# Altium schematic sheet [04] - CONNECTORS_2.SchDoc
size A4; DocumentNumber: 5; SheetNumber: 5; SheetTotal: 9
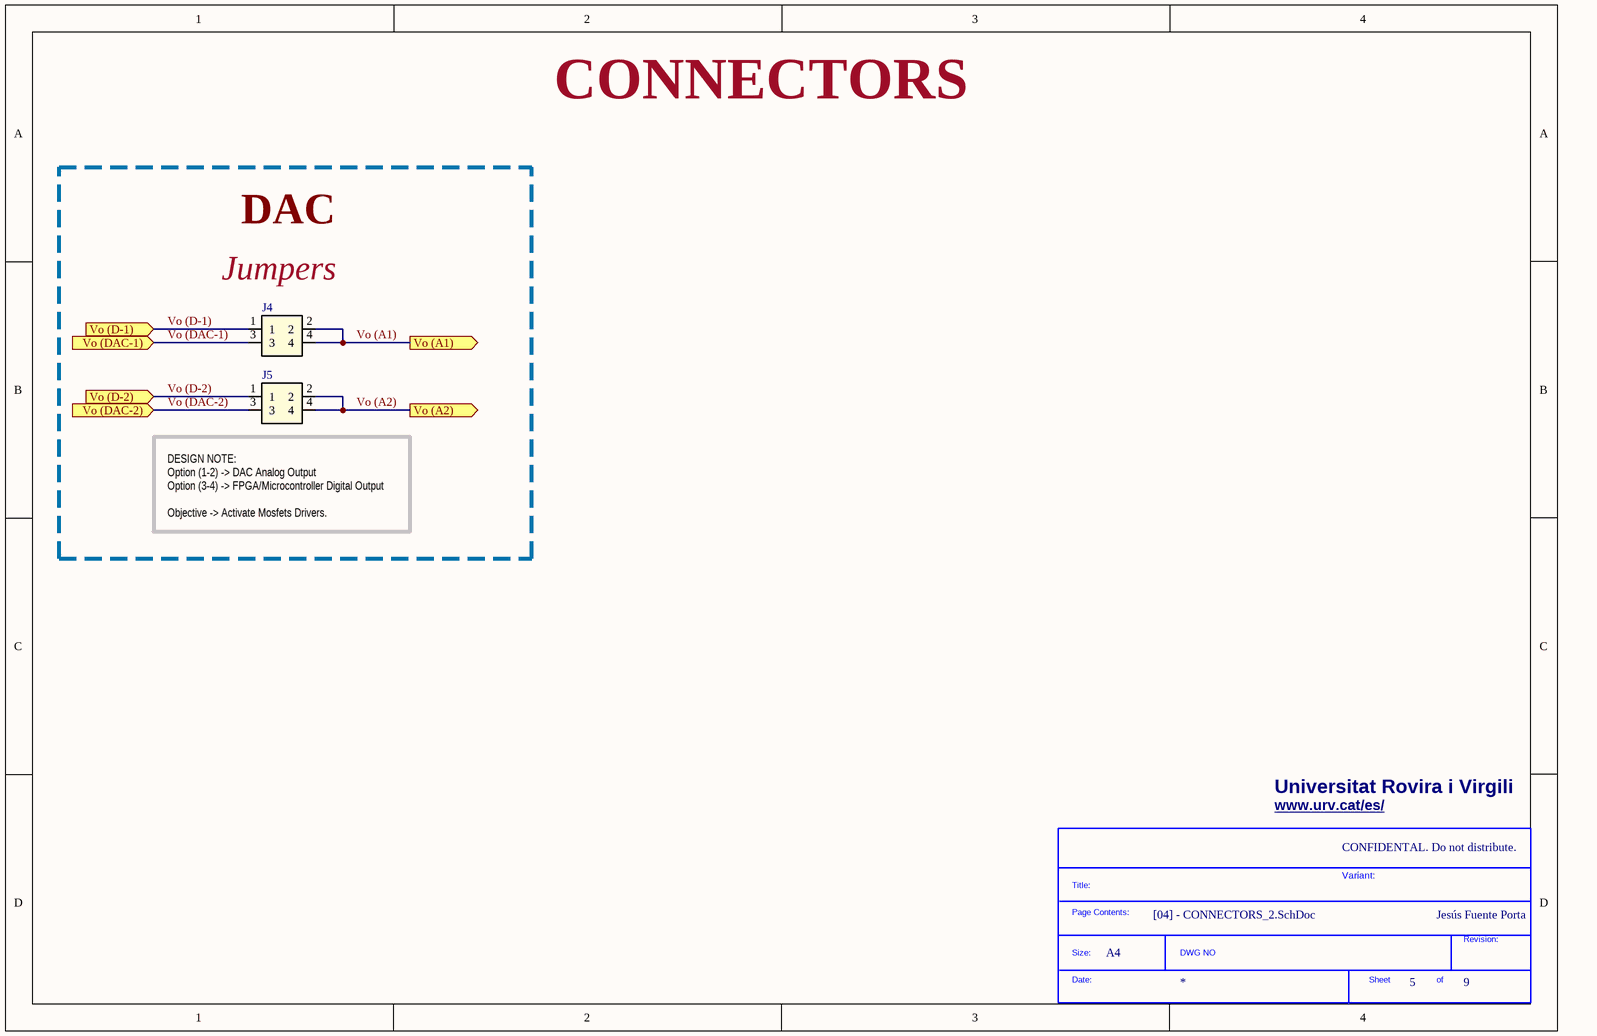
[diagram p0: [04] - CONNECTORS_2.SchDoc]

## Parts
*?  SDTitleBlock  (value not drawn)  (graphical)
J4  TMM-102-01-G-D00 (2 connectors)  [TMM-102-01-G-D00 (2 connectors)]  (value not drawn)
J5  TMM-102-01-G-D00 (2 connectors)  [TMM-102-01-G-D00 (2 connectors)]  (value not drawn)

## Blocks framed on the sheet
DAC: J4 J5

## Ports
Vo (A1) (out), Vo (A2) (out), Vo (D-1) (in), Vo (D-2) (in), Vo (DAC-1) (in), Vo (DAC-2) (in)

## Nets
Vo (A1): J4.2 J4.4 ; port Vo (A1)
Vo (A2): J5.2 J5.4 ; port Vo (A2)
Vo (D-1): J4.1 ; port Vo (D-1)
Vo (D-2): J5.1 ; port Vo (D-2)
Vo (DAC-1): J4.3 ; port Vo (DAC-1)
Vo (DAC-2): J5.3 ; port Vo (DAC-2)

## Notes on the sheet
- CONNECTORS
- (near J4) Jumpers
- (near J5) DESIGN NOTE:
  Option (1-2) -> DAC Analog Output
  Option (3-4) -> FPGA/Microcontroller Digital Output
  Objective -> Activate Mosfets Drivers.
- Universitat Rovira i Virgili
- www.urv.cat/es/ <http://www.urv.cat/es/>
- CONFIDENTAL. Do not distribute.
- Variant:
- Jesús Fuente Porta
- A4
- (in symbol SDTitleBlock) Title:; Page Contents:; Revision:; Size:; DWG NO; Date:; Sheet; of

## Library data of the parts
J4 J5 = TMM-102-01-G-D00 (2 connectors): TMM-102-01-L-D-SM -  Conector de Placa a Placa, 2 mm, 4 Contactos, Header, TMM Series, Montaje Superficial, 2 Filas; Vendor: Samtec Inc; Built_By: EMA_UL_Team; Manufacturer_Part_Number: TMM-102-01-L-D-SM; Copyright: Copyright (C) 2018 Accelerated Designs. All rights reserved; RefDes: RefDes; Type: DEV; Value: Value; ComponentLink1Description: Farnell WebPage; ComponentLink1URL: https://es.farnell.com/samtec/tmm-102-01-l-d-sm/conector-macho-4pos-2fila-2mm/dp/2856897?scope=partnumberlookahead&ost=TMM-102-01-L-D-SM&searchref=searchlookahead&exaMfpn=true&ddkey=https%3Aes-ES%2FElement14_Spain%2Fw%2Fsearch